# EAGLE design sqm-gps (EAGLE 6.4)
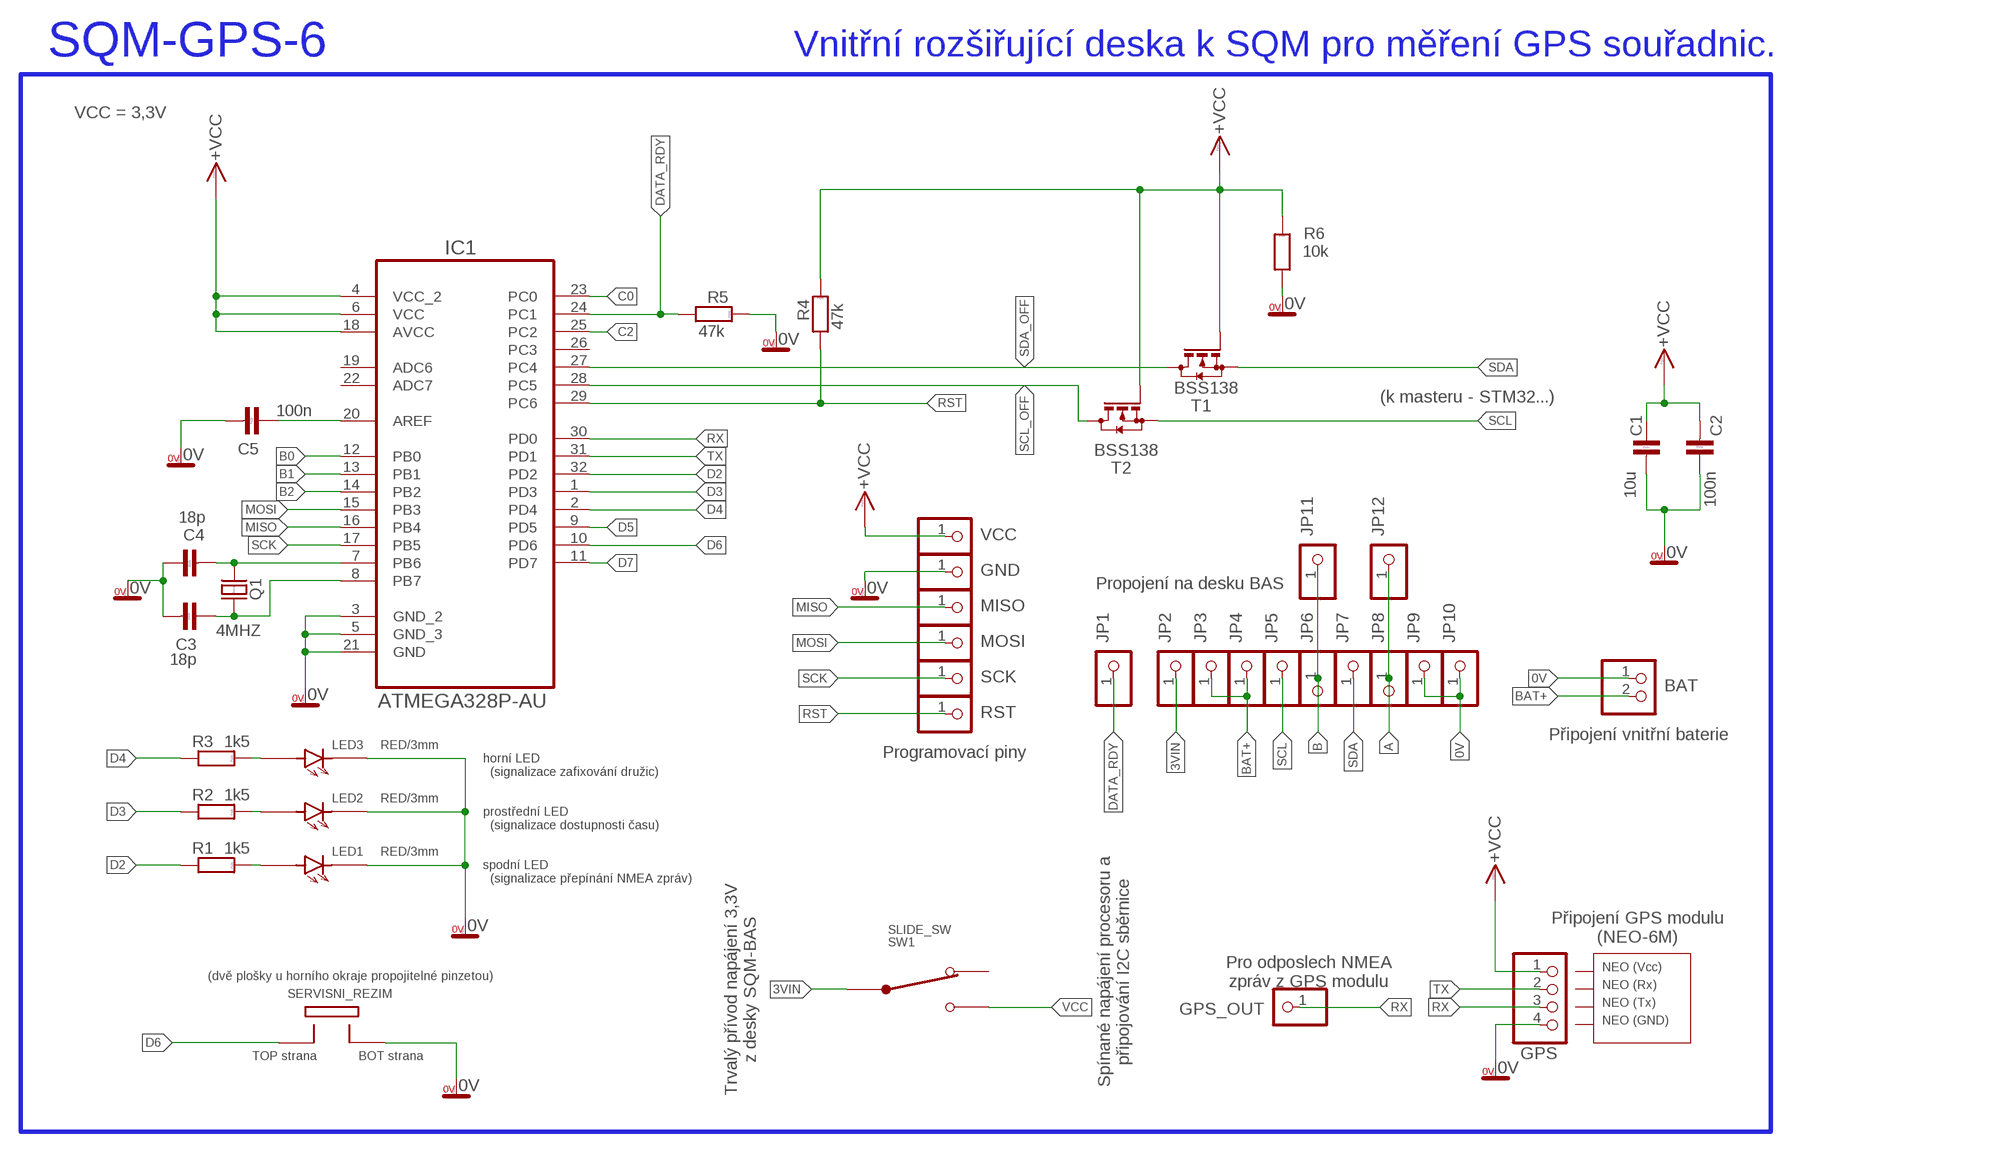
[diagram p0: schematic, sheet 1]

## Parts
BAT  PINHD-1X2  [1X02]
C1  10u  C-KERAMIK_SMD_1206  [1206]
C2  100n  C-KERAMIK_SMD_0805  [0805]
C3  18p  C-KERAMIK_SMD_0805  [0805]
C4  18p  C-KERAMIK_SMD_0805  [0805]
C5  100n  C-KERAMIK_SMD_0805  [0805]
GND  PINHD-1X1  [1X01]
GPS  PINHD-1X4  [1X04]
GPS_OUT  PINHD-1X1  [1X01]
IC1  ATMEGA328P-AU  [QFP80P900X900X120-32N]
JP1  PINHD-1X1  [1X01]
JP2  PINHD-1X1  [1X01]
JP3  PINHD-1X1  [1X01]
JP4  PINHD-1X1  [1X01]
JP5  PINHD-1X1  [1X01]
JP6  PINHD-1X1  [1X01]
JP7  PINHD-1X1  [1X01]
JP8  PINHD-1X1  [1X01]
JP9  PINHD-1X1  [1X01]
JP10  PINHD-1X1  [1X01]
JP11  PINHD-1X1  [1X01]
JP12  PINHD-1X1  [1X01]
LED1  RED/3mm  LED3MM_BOK  [LED3MM_BOK]
LED2  RED/3mm  LED3MM_BOK  [LED3MM_BOK]
LED3  RED/3mm  LED3MM_BOK  [LED3MM_BOK]
MISO  PINHD-1X1  [1X01]
MOSI  PINHD-1X1  [1X01]
Q1  4MHZ  Q_HC-49U  [HC-49U]
R1  1k5  R_SMD_0805  [0805]
R2  1k5  R_SMD_0805  [0805]
R3  1k5  R_SMD_0805  [0805]
R4  47k  R_SMD_0805  [0805]
R5  47k  R_SMD_0805  [0805]
R6  10k  R_SMD_0805  [0805]
RST  PINHD-1X1  [1X01]
SCK  PINHD-1X1  [1X01]
SERVISNI_REZIM  TOP_BOT_PIN  [TOP_BOT_PIN]
SW1  SLIDE_SW  [SLIDE_SW]
T1  BSS138  BSS123  [SOT23]
T2  BSS138  BSS123  [SOT23]
VCC  PINHD-1X1  [1X01]

## Nets
0V: BAT.1 C1.2 C2.1 C3.2 C4.1 C5.2 GND.1 GPS.4 IC1.3(GND_2) IC1.5(GND_3) IC1.21(GND) JP9.1 JP10.1 LED1.K LED2.K LED3.K R5.2 R6.1 SERVISNI_REZIM.P2
3VIN: JP2.1 SW1.PIN_COM
A: JP8.1 JP12.1
AREF: C5.1 IC1.20(AREF)
B: JP6.1 JP11.1
B0: IC1.12(PB0)
B1: IC1.13(PB1)
B2: IC1.14(PB2)
B6: C4.2 IC1.7(PB6) Q1.2
B7: C3.1 IC1.8(PB7) Q1.1
BAT+: BAT.2 JP3.1 JP4.1
C0: IC1.23(PC0)
C2: IC1.25(PC2)
D2: IC1.32(PD2) R1.1
D3: IC1.1(PD3) R2.1
D4: IC1.2(PD4) R3.1
D5: IC1.9(PD5)
D6: IC1.10(PD6) SERVISNI_REZIM.P1
D7: IC1.11(PD7)
DATA_RDY: IC1.24(PC1) JP1.1 R5.1
LED1_A1: LED1.A R1.2
LED2_A1: LED2.A R2.2
LED3_A1: LED3.A R3.2
MISO: IC1.16(PB4) MISO.1
MOSI: IC1.15(PB3) MOSI.1
RST: IC1.29(PC6) R4.1 RST.1
RX: GPS.3 GPS_OUT.1 IC1.30(PD0)
SCK: IC1.17(PB5) SCK.1
SCL: JP5.1 T2.2(S)
SCL_OFF: IC1.28(PC5) T2.3(D)
SDA: JP7.1 T1.2(S)
SDA_OFF: IC1.27(PC4) T1.3(D)
TX: GPS.2 IC1.31(PD1)
VCC: C1.1 C2.2 GPS.1 IC1.4(VCC_2) IC1.6(VCC) IC1.18(AVCC) R4.2 R6.2 SW1.PIN_2 T1.1(G) T2.1(G) VCC.1 ; supply symbol labelled +VCC
Unconnected: IC1.19(ADC6) IC1.22(ADC7) IC1.26(PC3) SW1.PIN_1

## Notes on the sheet
- SQM-GPS-6 | Vnitřní rozšiřující deska k SQM pro měření GPS souřadnic.
- VCC = 3,3V
- (k masteru - STM32...)
- Propojení na desku BAS
- Připojení vnitřní baterie
- Programovací piny
- horní LED
    (signalizace zafixování družic)
- prostřední LED
    (signalizace dostupnosti času)
- spodní LED
    (signalizace přepínání NMEA zpráv)
- Připojení GPS modulu
  (NEO-6M)
- Spínané napájení procesoru a
  připojování I2C sběrnice
- Pro odposlech NMEA
  zpráv z GPS modulu
- NEO (Vcc)
- (dvě plošky u horního okraje propojitelné pinzetou)
- Trvalý přívod napájení 3,3V
  z desky SQM-BAS
- NEO (Rx)
- NEO (Tx)
- NEO (GND)
- TOP strana | BOT strana

## Library data of the parts
BAT = pinhead:PINHD-1X2: PIN HEADER
C1-C5 = #PaJa_30:C-KERAMIK: Kondenzator - keramicky
GND GPS_OUT JP1-JP12 MISO MOSI RST SCK VCC = pinhead:PINHD-1X1: PIN HEADER
GPS = pinhead:PINHD-1X4: PIN HEADER
IC1 = Atmel-ATMEGA328P-AU:ATMEGA328P-AU; DESCRIPTION: 8-bit Microcontroller with In-System Programmable Flash; MPN: ATMEGA328P-AU; OC_FARNELL: 1715486; OC_NEWARK: 14R4631; PACKAGE: TQFP-32; SUPPLIER: Atmel
LED1-LED3 = LED3mm_BOK:LED3MM_BOK: LED na okraji desky
Q1 = #PaJa_30:Q_HC-49U: Krystal - 1MHz - 48MHz
R1-R6 = #PaJa_30:R: Rezistor
SERVISNI_REZIM = TOP_BOT_PIN:TOP_BOT_PIN
SW1 = SLIDE_SW:SLIDE_SW: Posuvny prepinac
T1 T2 = transistor-small-signal:BSS123: N-CHANNEL MOS FET

## Board
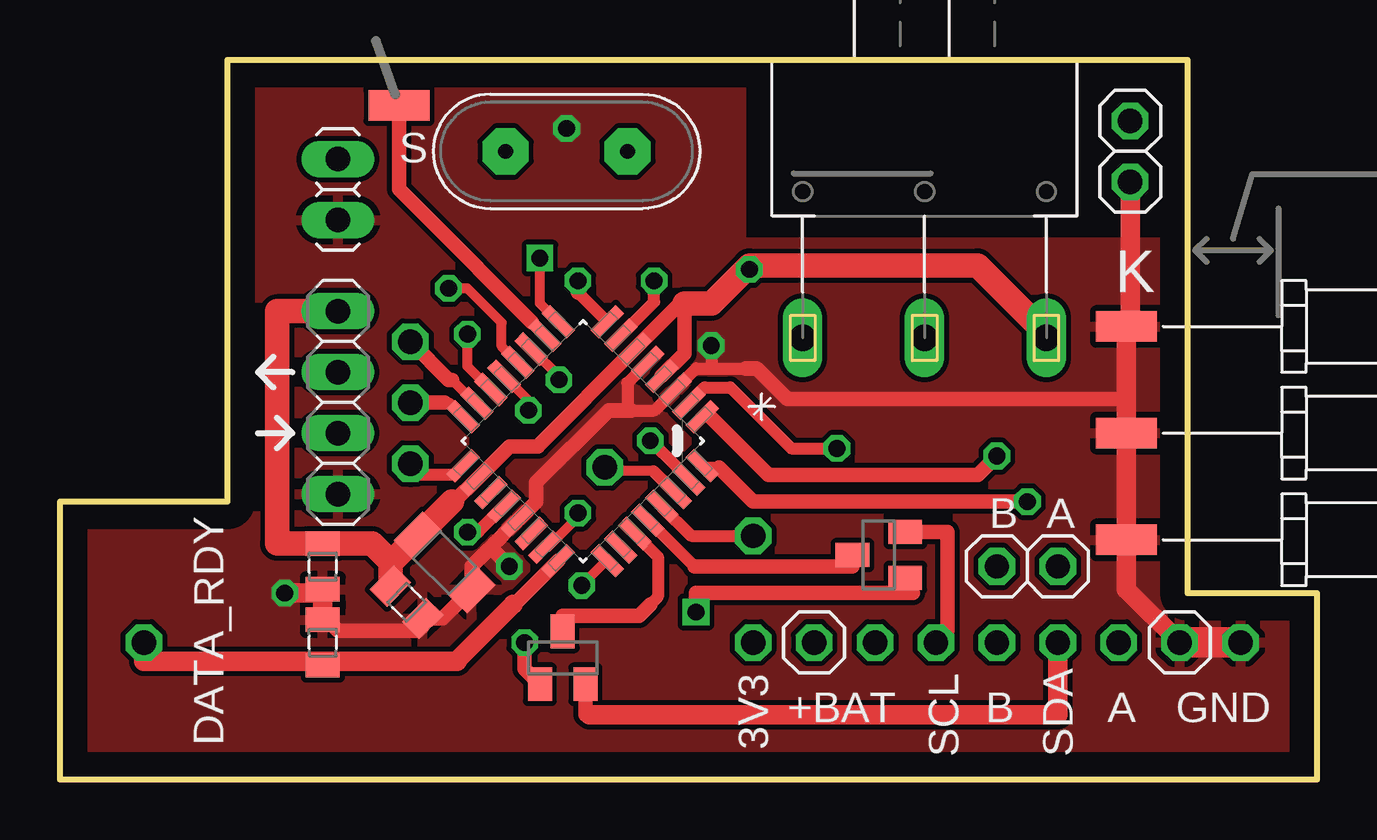
[diagram p1: board, top side]
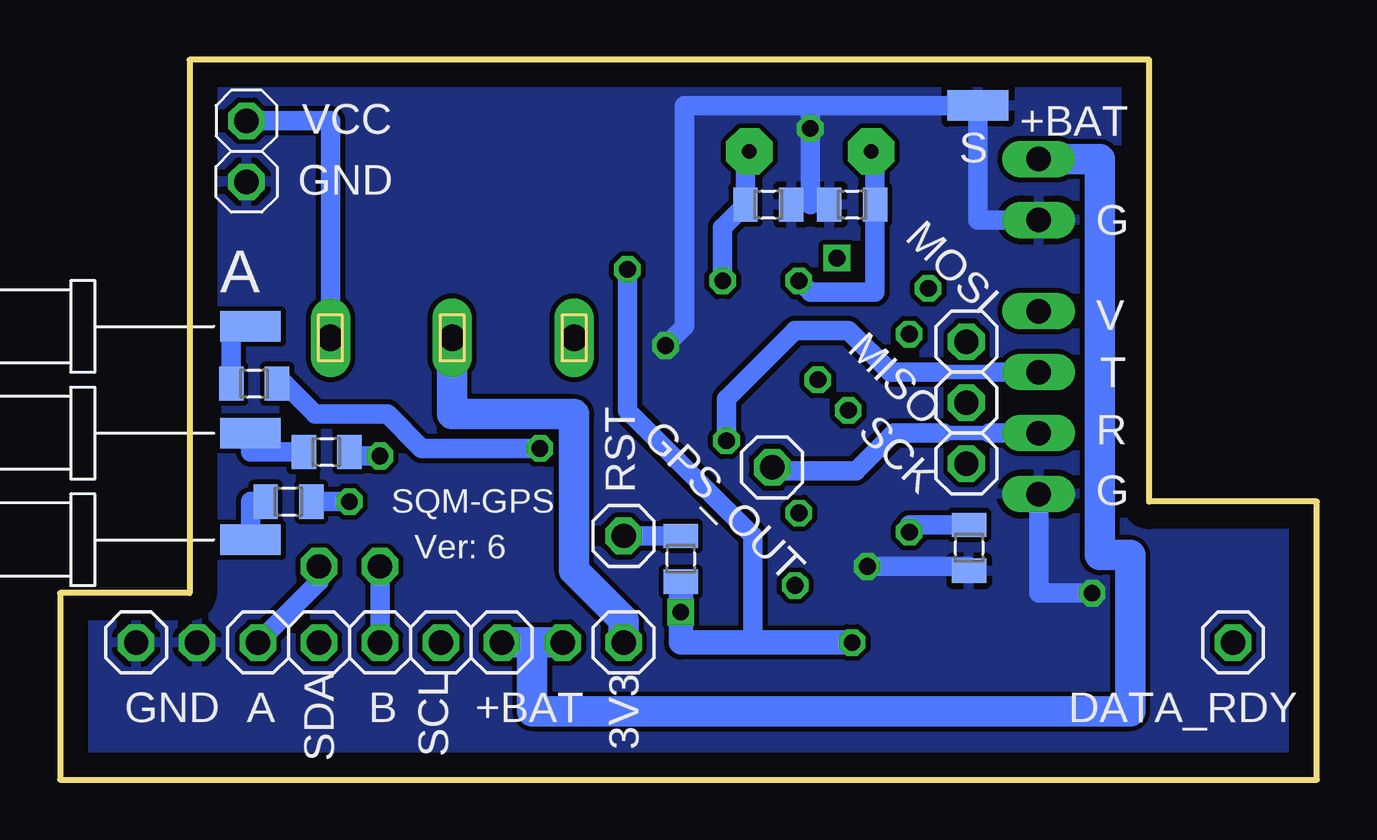
[diagram p2: board, bottom side, seen from below]

Size 52.39 x 30 mm. Coordinates in mm from the lower left corner, seen from the top.
Outline: 0,11.59 6.99,11.59 6.99,30 46.99,30 46.99,7.78 52.39,7.78 52.39,0 0,0 0,11.59
Copper layers (1*16): Top 0.035mm / dielectric 1.5mm / Bottom 0.035mm
Design rules "default *": minimum track width 10mil, minimum drill 24mil, track to track 8mil, track to pad 8mil, pad to pad 8mil, via to via 8mil, smd to smd 8mil, copper to edge 40mil, drill to drill 8mil, minimum pad ring 10mil, minimum via ring 8mil, stop-mask expansion 4mil, vias tented up to drill 0mil, thermal gap 10mil

### Footprints (pad centres in the part's own frame; a part is rotated, then mirrored left to right if it is on the bottom)
1X02 = drill 1.016 long: 1 -1.27,0; 2 1.27,0
1206 = smd 1.143 x 1.702: 1 -1.587,0; 2 1.587,0
0805 = smd 1.016 x 1.422: 1 -0.953,0; 2 0.953,0
1X01 = drill 1.016 octagon: 1 0,0
1X04 = drill 1.016 long: 1 -3.81,0; 2 -1.27,0; 3 1.27,0; 4 3.81,0
QFP80P900X900X120-32N = smd 1.473 x 0.508: 1 -4.242,2.794; 2 -4.242,2.007; 3 -4.242,1.194; 4 -4.242,0.406; 5 -4.242,-0.406; 6 -4.242,-1.194; 7 -4.242,-2.007; 8 -4.242,-2.794; 17 4.242,-2.794; 18 4.242,-2.007; 19 4.242,-1.194; 20 4.242,-0.406; 21 4.242,0.406; 22 4.242,1.194; 23 4.242,2.007; 24 4.242,2.794 | smd 0.508 x 1.473: 9 -2.794,-4.242; 10 -2.007,-4.242; 11 -1.194,-4.242; 12 -0.406,-4.242; 13 0.406,-4.242; 14 1.194,-4.242; 15 2.007,-4.242; 16 2.794,-4.242; 25 2.794,4.242; 26 2.007,4.242; 27 1.194,4.242; 28 0.406,4.242; 29 -0.406,4.242; 30 -1.194,4.242; 31 -2.007,4.242; 32 -2.794,4.242
LED3MM_BOK = smd 2.54 x 1.27 bottom: A 0,0 | smd 2.54 x 1.27: K 0,0
HC-49U = drill 0.61 pad 1.93 octagon: 1 -2.54,0; 2 2.54,0
TOP_BOT_PIN = smd 2.54 x 1.27: P1 0,0 | smd 2.54 x 1.27 bottom: P2 0,0
SLIDE_SW = drill 1.1 long: PIN_1 -5.08,-7.62; PIN_2 5.08,-7.62; PIN_COM 0,-7.62
SOT23 = smd 1 x 1.4: 1 -0.95,-1.1; 2 0.95,-1.1; 3 0,1.1

### Placement (x,y rotation side)
BAT  11.59,24.61 90 top
C1  16.03,9.05 315 top
C2  14.45,7.4 135 top
C3  19.37,23.97 180 bottom
C4  22.86,23.97 180 bottom
C5  14.49,9.66 270 bottom
GND  44.61,24.92 0 top
GPS  11.59,15.72 270 top
GPS_OUT  22.7,13.02 0 bottom
IC1  21.8,14.11 225 top
JP1  3.49,5.71 0 bottom
JP2  28.89,5.71 0 bottom
JP3  31.43,5.71 0 top
JP4  33.97,5.71 0 bottom
JP5  36.51,5.71 0 bottom
JP6  39.05,5.71 0 bottom
JP7  41.59,5.71 0 bottom
JP8  44.13,5.71 0 bottom
JP9  46.67,5.71 0 top
JP10  49.21,5.71 0 bottom
JP11  39.05,8.89 0 top
JP12  41.59,8.89 0 top
LED1  44.45,10 0 top
LED2  44.45,14.45 0 top
LED3  44.45,18.89 0 top
MISO  14.61,15.72 0 bottom
MOSI  14.61,18.26 0 bottom
Q1  21.11,26.19 0 top
R1  42.86,11.59 180 bottom
R2  41.27,13.65 180 bottom
R3  44.29,16.51 180 bottom
R4  26.51,9.21 270 bottom
R5  10.95,5.71 90 top
R6  10.95,8.89 90 top
RST  28.89,10.16 0 bottom
SCK  14.61,13.18 0 bottom
SERVISNI_REZIM  14.13,28.1 180 top
SW1  36.04,26.04 0 top
T1  20.95,5.08 0 top
T2  34.13,9.37 90 top
VCC  44.61,27.46 0 top

### Tracks (layer width: path | path; a pad name or v marks a point on that pad's centre or on a via)
0V  (via drill 0.7)
  Top 0.406: IC1.21 18.9,10.64
  Top 0.508: 23.81,15.4 24.77,15.4 IC1.3 26.52,17.14 27.15,17.14 | 23.65,15.4 23.65,16.54 IC1.5 | 27.15,17.14 28.57,17.14 | v27.15,18.1 27.15,17.14
  Top 0.61: LED2.K 44.45,15.88 30.32,15.88 29.05,17.14 28.57,17.14 | 18.9,10.64 19.84,11.58 19.84,12.38 22.86,15.4 23.02,15.4 23.65,15.4 23.81,15.4 | 11.11,6.67 11.59,6.19 14.92,6.19 15.12,6.39 C2.1 15.95,6.72 C1.2 17.16,8.9 17.86,9.6 | IC1.21 17.86,9.6 | v18.73,8.89 18.02,9.6 17.86,9.6
  Top 0.813: JP9.1 44.45,7.94 LED1.K LED2.K LED3.K 44.61,18.89 GND.1 | 10.95,7.78 R5.2 11.11,6.67 | 10.95,7.78 R6.1 | v9.37,7.78 10.95,7.78
  Top 1.27: JP9.1 JP10.1
  Bottom 0.61: C3.2 21.11,23.97 C4.1
  Bottom 0.813: 21.11,28.1 SERVISNI_REZIM.P2 14.13,23.34 BAT.1 | 21.11,28.1 v21.11,27.15 21.11,23.97 | 21.11,28.1 26.35,28.1 26.35,18.89 v27.15,18.1 | C5.2 14.49,8.89 v18.73,8.89 | GPS.4 11.59,7.78 v9.37,7.78
  pour Top: 6.99,11.59 0,11.59 0,0 52.39,0 52.39,7.78 46.99,7.78 46.99,22.38 28.42,22.38 28.42,30 6.99,30
  pour Bottom: 6.99,30 46.99,30 46.99,7.78 52.39,7.78 52.39,0 0,0 0,11.59 6.99,11.59
3VIN
  Bottom 0.813: 30.96,14.29 30.96,15.24
  Bottom 1.27: SW1.PIN_COM 36.04,15.24 30.96,15.24 30.96,8.73 28.89,6.67 JP2.1
A
  Bottom 0.813: JP8.1 41.59,8.26 JP12.1
AREF  (via drill 0.7)
  Top 0.508: IC1.20 17.43,10.32 v16.99,10.32
  Bottom 0.813: v16.99,10.32 16.99,10.62 C5.1
B
  Bottom 0.813: JP6.1 JP11.1
B0  (via drill 0.7)
  Top 0.406: IC1.12 18.41,18.06 18.41,19.05 16.99,20.48 v16.19,20.48
B1  (via drill 0.7)
  Top 0.406: IC1.13 19.53,15.8 v19.53,15.4
B2  (via drill 0.7)
  Top 0.406: IC1.14 16.99,17.23 v16.99,18.57
B6  (via drill 0.7)
  Top 0.508: IC1.7 24.77,19.92 v24.77,20.8
  Bottom 0.813: Q1.2 23.81,26.19 C4.2 24.77,23.02 v24.77,20.8
B7  (via drill 0.7)
  Top 0.508: 21.59,20.31 IC1.8
  Top 0.61: v21.59,20.8 21.59,20.31
  Bottom 0.813: Q1.1 18.41,26.19 C3.1 18.41,20.32 21.11,20.32 v21.59,20.8
BAT+
  Bottom 1.27: BAT.2 9.05,25.88 9.05,9.37 7.78,9.37 7.78,2.86 32.7,2.86 32.7,5.71 JP4.1 JP3.1
C0  (via drill 0.7)
  Top 0.406: IC1.23 20.33,9.69 21.59,10.95 v21.59,11.11
C2  (via drill 0.7)
  Top 0.406: IC1.25 22.79,9.13 v21.75,8.1
D2  (via drill 0.7)
  Top 0.406: IC1.32 26.84,13.02
  Top 0.508: 26.84,13.02 27.46,13.02
  Top 0.61: v40.32,11.59 28.89,11.59 27.46,13.02
  Bottom 0.813: v40.32,11.59 R1.1
D3  (via drill 0.7)
  Top 0.406: 26.99,15.24 26.88,15.13 IC1.1 27.09,15.13
  Top 0.61: 27.09,15.13 29.53,12.7 38.26,12.7 v39.05,13.49
  Bottom 0.813: v39.05,13.49 40.32,13.49 R2.1
D4  (via drill 0.7)
  Top 0.508: IC1.2 26.88,16.35 27.94,16.35 30.48,13.81 v32.38,13.81
  Bottom 0.813: v32.38,13.81 37.31,13.81 38.73,15.24 41.75,15.24 43.02,16.51 R3.1
D5  (via drill 0.7)
  Top 0.406: IC1.9 20,19.85 v20,21.75
D6
  Top 0.406: 19.84,18.89 19.68,19.05 | 15.88,22.86 | IC1.10 18.98,19.76 18.97,19.76
  Top 0.61: 19.68,19.05 18.97,19.76 15.88,22.86 | 15.88,22.86 14.13,24.61 SERVISNI_REZIM.P1
D7  (via drill 0.7)
  Top 0.406: 19.68,17.94 20.8,16.83 v20.8,16.67 20.8,16.8 IC1.11
DATA_RDY
  Top 0.508: IC1.24 19.84,8.21
  Top 0.61: 16.56,4.92 IC1.24 | IC1.24
  Top 0.813: 10.95,4.92 3.49,4.92 JP1.1 | R5.1 10.95,4.92 | 10.95,4.92 16.51,4.92 | 16.51,4.92 16.56,4.92 | 16.51,4.92 18.89,7.3
LED1_A1
  Bottom 0.813: R1.2 44.45,11.59 LED1.A
LED2_A1
  Bottom 0.813: R2.2 44.45,13.65 LED2.A
LED3_A1
  Bottom 0.813: R3.2 45.24,18.89 LED3.A
MISO
  Top 0.406: 15.44,15.72 MISO.1 | IC1.16 16.24,15.72 16.03,15.72
  Top 0.61: 16.03,15.72 MISO.1
MOSI
  Top 0.406: IC1.15 17.33,15.69 16.35,16.67
  Top 0.61: 16.35,16.67 16.19,16.67 MOSI.1
RST
  Top 0.508: IC1.29 26.32,10.16 RST.1
  Bottom 0.813: R4.1 RST.1
RX
  Top 0.406: 24.73,12.86 22.7,12.86 GPS_OUT.1
  Top 0.508: IC1.30 24.73,12.86
  Bottom 0.61: 13.65,14.45 15.56,14.45
  Bottom 0.813: GPS.3 13.65,14.45 | 15.56,14.45 17.62,14.45 19.21,12.86 22.7,12.86 GPS_OUT.1
SCK
  Top 0.406: IC1.17 16.43,12.7
  Top 0.508: 16.43,12.7 14.61,12.7
  Top 0.61: 14.61,12.7 SCK.1
SCL
  Top 0.61: T2.2 36.99,10.32 36.99,7.46 36.99,6.19 JP5.1
SCL_OFF
  Top 0.508: IC1.28 26.44,8.89
  Top 0.61: 26.44,8.89 31.43,8.89 32.87,8.89 33.03,8.89 T2.3
SDA
  Top 0.61: T1.2 21.91,2.7 22.07,2.7
  Top 0.813: 22.07,2.7 41.59,2.7 JP7.1
SDA_OFF
  Top 0.508: IC1.27 24.92,9.29 24.92,7.62 24.61,7.3
  Top 0.61: T1.3 20.95,6.83 24.13,6.83 24.61,7.3
TX  (via drill 0.7)
  Top 0.406: 25.09,13.65 25.08,13.65
  Top 0.508: IC1.31 25.09,13.65 | v24.61,14.13 25.08,13.65
  Bottom 0.61: 13.49,16.99 15.72,16.99
  Bottom 0.813: GPS.2 13.49,16.99 | 15.72,16.99 17.78,16.99 19.53,18.73 21.75,18.73 24.61,15.88 v24.61,14.13
VCC  (via drill 0.7)
  Top 0.61: 26.04,19.84 26.04,17.77 IC1.4 | 16.35,11.59 16.44,11.59 IC1.18 18.73,13.88 19.92,13.88 19.92,13.92 IC1.6 25.84,19.84 27.15,19.84 | T1.1 19.37,4.62 v19.37,5.71 | 35.23,7.78 26.51,7.78 v26.51,6.99 | T2.1 35.23,7.78 | 35.23,7.78 35.55,7.78
  Top 0.813: C2.2 13.65,8.07 | 41.12,18.57 SW1.PIN_2 | v28.73,21.27 28.73,21.43 | R6.2 10.96,9.85 13.02,9.85
  Top 1.016: 11.11,9.85 13.02,9.85 13.02,9.84 13.8,9.06 | 16.35,11.59 14.93,10.17 C1.1 13.8,9.06 | 26.04,19.84 27.15,19.84 28.73,21.43 38.26,21.43 41.12,18.57 | GPS.1 9.05,19.53 9.05,9.84 R6.2 | 13.8,9.06 13.77,9.03 C2.2
  Bottom 0.61: 26.51,5.71 26.67,5.71
  Bottom 0.813: VCC.1 41.12,27.46 SW1.PIN_2 | v19.37,5.71 23.5,5.71 23.5,10.16 28.73,15.4 v28.73,21.27
  Bottom 1.016: R4.2 v26.51,6.99 26.51,5.71 v19.37,5.71

### Text on the board
tPlace: S | K | B | A | 3V3 | SCL | +BAT | B | A | GND | DATA_RDY | SDA
bPlace: +BAT | S | G | MOSI | A | V | MISO | T | RST | R | SCK | G | SQM-GPS | Ver: 6 | DATA_RDY | 3V3 | SCL | SDA | +BAT | B | A | GND
tDocu: Vnitřní deska GPS (ver. 6) pro SQM / TOP strana | OFF | ON | LED osadit 3mm nad / hranu plošného spoje
bDocu: Vnitřní deska GPS (ver. 6) pro SQM / BOT strana | D5 | B0 | B2 | D7 | B1 | C0 | C2 | Pro piny JP2 až JP10 je možné použít 90° kolíkovou lištu, ze které se odstraní některé piny. | Pin JP1 musí být osazen samostatně / (plast mezi JP1 a JP2 by překážel obvodu AP1501 na desce SQM-BAS). | Programovací piny (MISO / MOSI / SCK / RST / VCC / GND) / se po naprogramování procesoru odstraní.